# Altium schematic sheet Power.SchDoc
size A4; SheetNumber: 4; SheetTotal: 10
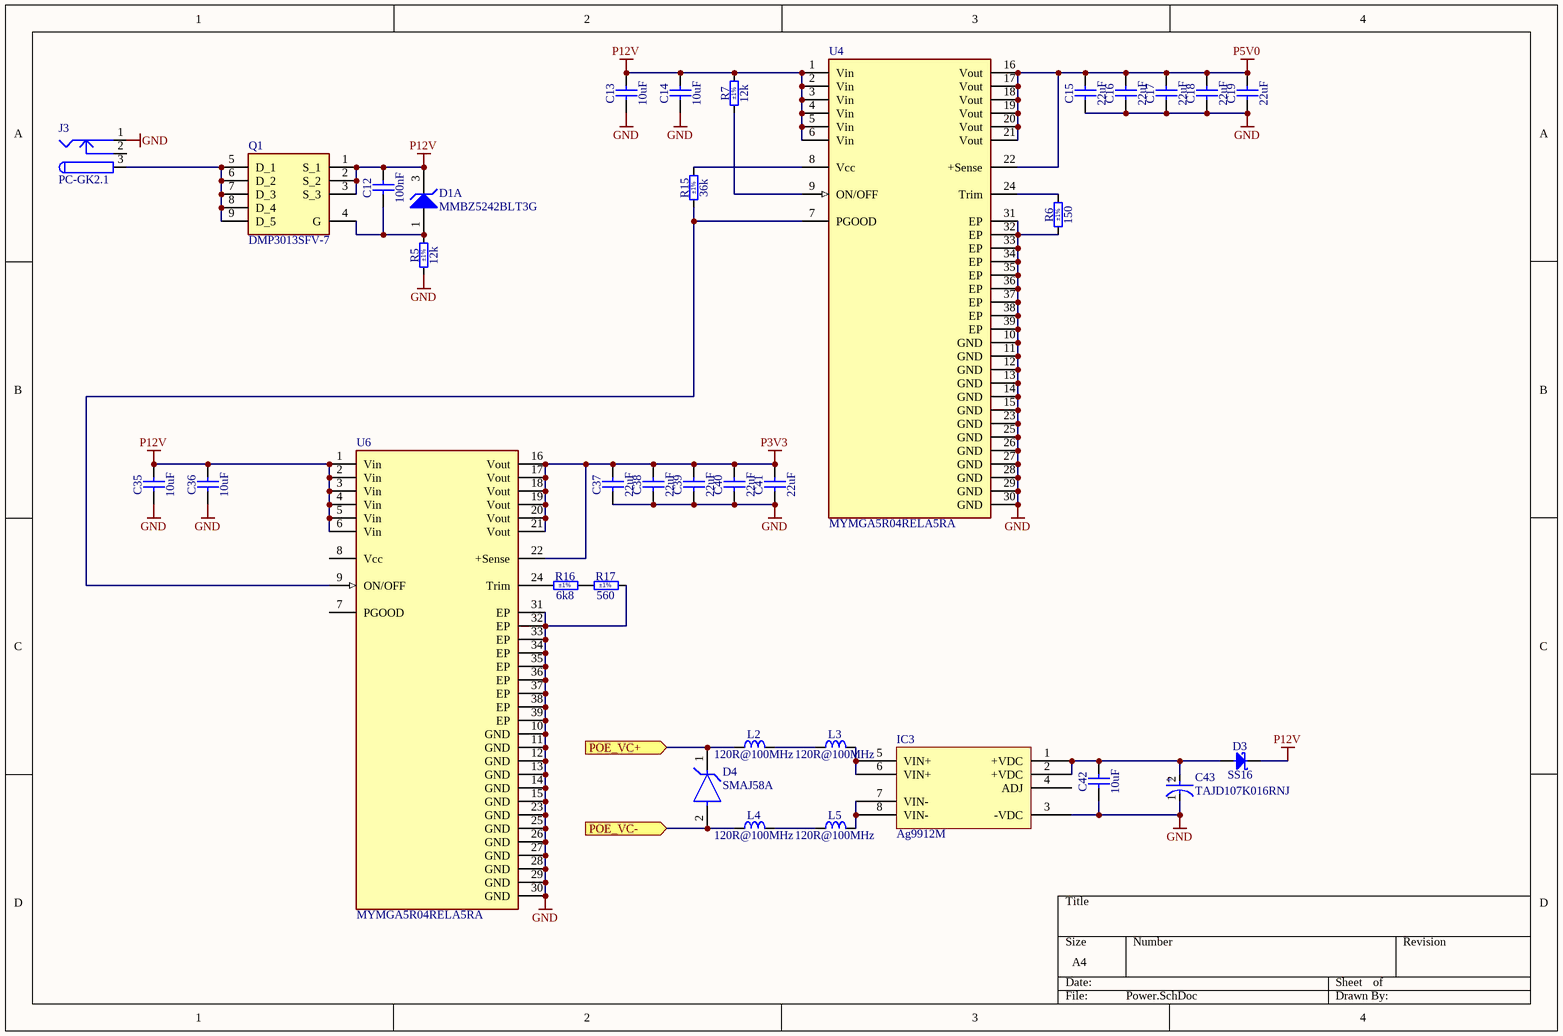
[diagram p0: Power.SchDoc]

## Parts
C12  100nF  [CAPC1005X55N]
C13  10uF  [CAPC2012X95N]
C14  10uF  [CAPC2012X95N]
C15  22uF  [CAPC2012X135N]
C16  22uF  [CAPC2012X135N]
C17  22uF  [CAPC2012X135N]
C18  22uF  [CAPC2012X135N]
C19  22uF  [CAPC2012X135N]
C35  10uF  [CAPC2012X95N]
C36  10uF  [CAPC2012X95N]
C37  22uF  [CAPC2012X135N]
C38  22uF  [CAPC2012X135N]
C39  22uF  [CAPC2012X135N]
C40  22uF  [CAPC2012X135N]
C41  22uF  [CAPC2012X135N]
C42  10uF  [CAPC2012X95N]
C43  TAJD107K016RNJ  [FP-TAJD-MFG]
D1  MMBZ5242BLT3G  [ONSC-SOT-23-3-318-08_V]  (part A of 2)
D3  SS16  [DIOM5127X229N]
D4  SMAJ58A  [FP-SMAJ-MFG]
IC3  Ag9912M  [Ag9900M]
J3  PC-GK2.1  [DC2020]
L2  120R@100MHz  [INDC1608X65N]
L3  120R@100MHz  [INDC1608X65N]
L4  120R@100MHz  [INDC1608X65N]
L5  120R@100MHz  [INDC1608X65N]
Q1  DMP3013SFV-7  [DMP3013SFV7]
R5  12k  Tolerance: ±1%  [RESC1005X40N]
R6  150  Tolerance: ±1%  [RESC1005X40N]
R7  12k  Tolerance: ±1%  [RESC1005X40N]
R15  36k  Tolerance: ±1%  [RESC1005X40N]
R16  6k8  Tolerance: ±1%  [RESC1005X40N]
R17  560  Tolerance: ±1%  [RESC1005X40N]
U4  MYMGA5R04RELA5RA  [FP-MYMGA-MFG]
U6  MYMGA5R04RELA5RA  [FP-MYMGA-MFG]

## Ports
POE_VC+ (in), POE_VC- (in)

## Nets
GND: C13.1 C14.1 C15.1 C16.1 C17.1 C18.1 C19.1 C35.1 C36.1 C37.1 C38.1 C39.1 C40.1 C41.1 C42.1 C43.1(C) IC3.3(-VDC) J3.1 R5.1 R6.1 R17.2 U4.10(GND) U4.11(GND) U4.12(GND) U4.13(GND) U4.14(GND) U4.15(GND) U4.23(GND) U4.25(GND) U4.26(GND) U4.27(GND) U4.28(GND) U4.29(GND) U4.30(GND) U4.31(EP) U4.32(EP) U4.33(EP) U4.34(EP) U4.35(EP) U4.36(EP) U4.37(EP) U4.38(EP) U4.39(EP) U6.10(GND) U6.11(GND) U6.12(GND) U6.13(GND) U6.14(GND) U6.15(GND) U6.23(GND) U6.25(GND) U6.26(GND) U6.27(GND) U6.28(GND) U6.29(GND) U6.30(GND) U6.31(EP) U6.32(EP) U6.33(EP) U6.34(EP) U6.35(EP) U6.36(EP) U6.37(EP) U6.38(EP) U6.39(EP)
P3V3: C37.2 C38.2 C39.2 C40.2 C41.2 U6.16(Vout) U6.17(Vout) U6.18(Vout) U6.19(Vout) U6.20(Vout) U6.21(Vout) U6.22(+Sense)
P5V0: C15.2 C16.2 C17.2 C18.2 C19.2 U4.16(Vout) U4.17(Vout) U4.18(Vout) U4.19(Vout) U4.20(Vout) U4.21(Vout) U4.22(+Sense)
P12V: C12.2 C13.2 C14.2 C35.2 C36.2 D1.3(K) D3.1(C) Q1.1(S_1) Q1.2(S_2) Q1.3(S_3) R7.2 U4.1(Vin) U4.2(Vin) U4.3(Vin) U4.4(Vin) U4.5(Vin) U4.6(Vin) U6.1(Vin) U6.2(Vin) U6.3(Vin) U6.4(Vin) U6.5(Vin) U6.6(Vin)
POE_VC+: D4.1(C) L2.1 ; port POE_VC+
POE_VC-: D4.2(A) L4.1 ; port POE_VC-
NetC12_1: C12.1 D1.1(A) Q1.4(G) R5.2
NetC42_2: C42.2 C43.2(A) D3.2(A) IC3.1(+VDC) IC3.2(+VDC)
NetIC3_5: IC3.5(VIN+) IC3.6(VIN+) L3.2
NetIC3_7: IC3.7(VIN-) IC3.8(VIN-) L5.2
NetJ3_3: J3.3 Q1.5(D_1) Q1.6(D_2) Q1.7(D_3) Q1.8(D_4) Q1.9(D_5)
NetL2_2: L2.2 L3.1
NetL4_2: L4.2 L5.1
NetR6_2: R6.2 U4.24(Trim)
NetR7_1: R7.1 U4.9(ON/OFF)
NetR15_1: R15.1 U4.7(PGOOD) U6.9(ON/OFF)
NetR15_2: R15.2 U4.8(Vcc)
NetR16_1: R16.1 U6.24(Trim)
NetR16_2: R16.2 R17.1

Not connected (* = marked no-connect by the designer): IC3 4(ADJ); J3 2; U6 7(PGOOD) 8(Vcc)

## Notes on the sheet
- (in symbol CMP-2000-05064-2) +

## Library data of the parts
C12 = CC0402_100NF_16V_10%_X5R: Non-polarised capacitor; Manufacturer: GENERIC; Part Description: SMD Multilayer Chip Ceramic Capacitor; Manufacturer1 Part Number: GRM155R61C104KA88D; Tolerance: ±10%; Voltage: 16V; TC: X5R; Manufacturer Part Number: CC0402_100NF_16V_10%_X5R; Part Number: CC0402_100NF_16V_10%_X5R; Value: 100nF; Component Kind: Standard; Component Type: Standard; Pin Count: 2; Status: None; Case: 0402; Mounted: Yes; Socket: No; SMD: Yes; Sense: No; Manufacturer1 Example: MURATA; Manufacturer1 ComponentHeight: 0.55mm; HelpURL: \\cern.ch\dfs\Applications\Altium\Datasheets\CC0402_X5R_MURATA_GRM.pdf; Author: CERN DEM JLC; CreateDate: 10.12.2013; LatestRevisionDate: 10.12.2013
C13 C14 C35 C36 C42 = CC0805_10UF_25V_10%_X5R: Non-polarised capacitor; Part Description: SMD Multilayer Chip Ceramic Capacitor; Manufacturer: GENERIC; Manufacturer1 Part Number: GRM219R61E106KA12D; Voltage: 25V; TC: X5R; Tolerance: ±10%; Part Number: CC0805_10UF_25V_10%_X5R; Component Kind: Standard; Component Type: Standard; Pin Count: 2; Value: 10uF; Status: Preferred; Manufacturer Part Number: CC0805_10UF_25V_10%_X5R; Case: 0805; Mounted: Yes; Socket: No; SMD: Yes; Sense: No; Manufacturer1 Example: MURATA; Manufacturer1 ComponentHeight: 0.95mm; HelpURL: \\cern.ch\dfs\Applications\Altium\Datasheets\CC0805_X5R_MURATA_GRM.pdf; Author: CERN DEM JLC; CreateDate: 25.10.2012; LatestRevisionDate: 06.09.2016
C15-C19 C37-C41 = CC0805_22UF_10V_+80%-20%_Y5V: Non-polarised capacitor; Part Description: SMD Multilayer Chip Ceramic Capacitor; Manufacturer: GENERIC; Manufacturer1 Part Number: 2222 241 19881; Voltage: 10V; TC: Y5V; Part Number: CC0805_22UF_10V_+80%-20%_Y5V; Component Kind: Standard; Component Type: Standard; Pin Count: 2; Value: 22uF; Status: Preferred; Tolerance: +80% -20%; Manufacturer Part Number: CC0805_22UF_10V_+80%-20%_Y5V; Case: 0805; Mounted: Yes; Socket: No; SMD: Yes; Sense: No; Manufacturer1 Example: PHYCOMP; Manufacturer1 ComponentHeight: 1.45mm; HelpURL: \\cern.ch\dfs\Applications\Altium\Datasheets\CC0805_Y5V_PHYCOMP.pdf; Author: CERN DEM JLC; CreateDate: 03.12.2007; LatestRevisionDate: 03.12.2007
C43 = CMP-2000-05064-2: 100uF 16V  ±10% 600mΩ 2917  SMD Tantalum Capacitor; Dissipation Factor: 6%; Polarity: Polar; Leakage Current: 16uA; ESR (Equivalent Series Resistance): 600mR; Depth: 4.3mm; Series: TAJ; Case Code (Metric): 7343; Min Operating Temperature: -55°C; Packaging: Tape and Reel; Termination: SMD/SMT; Voltage Rating (DC): 16V; Case/Package: 2917; Number of Pins: 2; Width: 4.3mm; Mount: Surface Mount; Tolerance: 10%; Voltage: 16V; Radiation Hardening: No; Lead Free: Lead Free; Capacitance: 100uF; Height: 2.9mm; RoHS Compliant: Yes; Max Operating Temperature: 125°C; Construction: Flat; Height - Seated (Max): 0.122inch; Case Code (Imperial): 2917; Package Quantity: 1; Dielectric Material: Tantalum; REACH SVHC: No SVHC; Features: General Purpose; Voltage Rating: 16V; Length: 7.3mm
D1 = CMP-1060-01195-1: Zener Voltage Regulator, 225 mW, 3-Pin SOT-23, Pb-Free, Tape and Reel; Manufacturer: On Semiconductor; VZ Typ (V): 12; PackageReference: SOT-23-3-318-08; RoHS: Pb-Free; PartNumber: MMBZ5242BLT3G; ComponentLink1Description: Manufacturer URL; ComponentLink3Description: Package Specification; ComponentLink3URL: http://www.onsemi.cn/pub_link/Collateral/318-08.PDF; PackageVersion: Rev. AP, 11/2009; ComponentLink1URL: http://www.onsemi.com/; Packing: Tape and Reel; ComponentLink2URL: http://www.onsemi.cn/pub_link/Collateral/MMBZ5221BLT1-D.PDF; PackageDescription: 3-Pin Small Outline Transistor, Body 2.92 x 1.3 mm, Pitch 0.95 mm; DatasheetVersion: Rev. 12; ComponentLink2Description: Datasheet; Mounting Technology: Surface Mount
D3 = SS16: Schottky Diode; Part Description: Surface Mount Schottky Barrier Rectifier; Manufacturer: VISHAY GENERAL SEMICONDUCTOR; Voltage: 60V; Power: 1A; PressFit: No; Bonding: No; Part Number: SS16; Component Kind: Standard; Component Type: Standard; Device: SS16; PackageDescription: DO-214-AC Molded Diode, Body 5.1x2.7mm, IPC Medium Density; Manufacturer Part Number: SS16; Pin Count: 2; Case: DO-214AC; Mounted: Yes; Socket: No; SMD: Yes; Sense: No; ComponentHeight: 2.29mm; HelpURL: \\cern.ch\dfs\Applications\Altium\Datasheets\SS16.pdf; Author: CERN DEM JLC; CreateDate: 15.07.2008; LatestRevisionDate: 23.08.2010
D4 = CMP-07401-000004-1: TVS DIODE 58V 93.6V SMA; Manufacturer: Bourns Inc.; Max Junction Temp: +150°C; Breakdown Voltage: 64.4V; Number Of Channels: 1; Peak Pulse Power: 400W; Peak Pulse Current: 4.3A; Direction: Unidirectional; Temperature Range High: +150°C; Clamping Voltage: 93.6V; Package: SMAJ; ComponentLink2Description: Datasheet; Temperature Range Low: -55°C; Mouser Description: TVS Diodes - Transient Voltage Suppressors 58volts 5uA 4.3 Amps Uni-Dir; Category: Diode; ComponentLink2URL: https://www.bourns.com/docs/Product-Datasheets/SMAJ.pdf; Temperature: -55°C to +150°C; Device Class L3: unset; Automotive: No; Device Class L2: TVS Diodes; Digikey Description: TVS DIODE 58V 93.6V SMA; Lead Free: Yes; Octopart: https://octopart.com/smaj58a-bourns-12809395; Device Class L1: Circuit Protection; Manufacturer Part Number: SMAJ58A; Reverse Standoff Voltage: 58V; Height: 2.29mm; RoHS: TRUE
IC3 = Ag9900M
J3 = CON_DC_JACK_TH: Low Voltage Power Supply Connector (maritex); Published: 17-Dec-2003; Datasheet: Latest Revision: 09-May-2002; Publisher: Altium Limited; Supplier 1: TME; Supplier Part Number 1: PC-GK2.1
L2-L5 = IND0603_MURATA_BLM18SG121TN1D: Inductor; Part Description: SMD EMIFIL Suppression Chip Ferrite Bead; Manufacturer: MURATA; Power: 3A; Resistance: 0.025R; Tolerance: ±25%; Table: Inductors SMD; Part Number: IND0603_MURATA_BLM18SG121TN1D; Component Kind: Standard; Component Type: Standard; Pin Count: 2; Value: 120R@100MHz; Status: None; Manufacturer Part Number: BLM18SG121TN1D; Case: 0603; Mounted: Yes; Socket: No; SMD: Yes; ComponentHeight: 0.65mm; HelpURL: \\cern.ch\dfs\Applications\Altium\Datasheets\IND0603_MURATA_BLM18S.pdf; Author: CERN DEM JLC; CreateDate: 2014-07-23; LatestRevisionDate: 2014-07-23
Q1 = DMP3013SFV-7: MOSFET (P-Channel); Manufacturer_Name: Diodes Inc.; Datasheet Link: https://4donline.ihs.com/images/VipMasterIC/IC/DIOD/DIOD-S-A0008513542/DIOD-S-A0008513542-1.pdf?hkey=52A5661711E402568146F3353EA87419; Height: 0.85mm; Manufacturer_Part_Number: DMP3013SFV-7
R5 R7 = R0402_12K_1%_0.0625W_100PPM: Resistor - 1%; Part Description: General Purpose Thick Film Chip Resistor; Manufacturer: GENERIC; Manufacturer1 Part Number: 232270671203L; TC: ±100ppm/°C; PressFit: No; Part Number: R0402_12K_1%_0.0625W_100PPM; Component Kind: Standard; Component Type: Standard; Pin Count: 2; Value: 12k; Status: Not Recommended; Power: 0.0625W; Manufacturer Part Number: R0402_12K_1%_0.0625W_100PPM; Case: 0402; Mounted: Yes; Sense: No; Socket: No; SMD: Yes; Manufacturer1 Example: YAGEO PHYCOMP; Manufacturer1 ComponentHeight: 0.4mm; HelpURL: \\cern.ch\dfs\Applications\Altium\Datasheets\R0402_Phycomp_RC0402.pdf; Author: CERN DEM JLC; CreateDate: 03.12.2007; LatestRevisionDate: 17.10.2012
R6 = R0402_150R_1%_0.0625W_100PPM: Resistor - 1%; Part Description: General Purpose Thick Film Chip Resistor; Manufacturer: GENERIC; Manufacturer1 Part Number: 232270671501L; TC: ±100ppm/°C; PressFit: No; Part Number: R0402_150R_1%_0.0625W_100PPM; Component Kind: Standard; Component Type: Standard; Pin Count: 2; Value: 150; Status: Not Recommended; Power: 0.0625W; Manufacturer Part Number: R0402_150R_1%_0.0625W_100PPM; Case: 0402; Mounted: Yes; Sense: No; Socket: No; SMD: Yes; Manufacturer1 Example: YAGEO PHYCOMP; Manufacturer1 ComponentHeight: 0.4mm; HelpURL: \\cern.ch\dfs\Applications\Altium\Datasheets\R0402_Phycomp_RC0402.pdf; Author: CERN DEM JLC; CreateDate: 03.12.2007; LatestRevisionDate: 17.10.2012
R15 = R0402_36K_1%_0.0625W_100PPM: Resistor - 1%; Part Description: General Purpose Thick Film Chip Resistor; Manufacturer: GENERIC; Manufacturer1 Part Number: 232270673603L; TC: ±100ppm/°C; PressFit: No; Part Number: R0402_36K_1%_0.0625W_100PPM; Component Kind: Standard; Component Type: Standard; Pin Count: 2; Value: 36k; Status: Not Recommended; Power: 0.0625W; Manufacturer Part Number: R0402_36K_1%_0.0625W_100PPM; Case: 0402; Mounted: Yes; Sense: No; Socket: No; SMD: Yes; Manufacturer1 Example: YAGEO PHYCOMP; Manufacturer1 ComponentHeight: 0.4mm; HelpURL: \\cern.ch\dfs\Applications\Altium\Datasheets\R0402_Phycomp_RC0402.pdf; Author: CERN DEM JLC; CreateDate: 03.12.2007; LatestRevisionDate: 17.10.2012
R16 = R0402_6K8_1%_0.0625W_100PPM: Resistor - 1%; Part Description: General Purpose Thick Film Chip Resistor; Manufacturer: GENERIC; Manufacturer1 Part Number: 232270676802L; TC: ±100ppm/°C; PressFit: No; Part Number: R0402_6K8_1%_0.0625W_100PPM; Component Kind: Standard; Component Type: Standard; Pin Count: 2; Value: 6k8; Status: Not Recommended; Power: 0.0625W; Manufacturer Part Number: R0402_6K8_1%_0.0625W_100PPM; Case: 0402; Mounted: Yes; Sense: No; Socket: No; SMD: Yes; Manufacturer1 Example: YAGEO PHYCOMP; Manufacturer1 ComponentHeight: 0.4mm; HelpURL: \\cern.ch\dfs\Applications\Altium\Datasheets\R0402_Phycomp_RC0402.pdf; Author: CERN DEM JLC; CreateDate: 03.12.2007; LatestRevisionDate: 17.10.2012
R17 = R0402_560R_1%_0.0625W_100PPM: Resistor - 1%; Part Description: General Purpose Thick Film Chip Resistor; Manufacturer: GENERIC; Manufacturer1 Part Number: 232270675601L; TC: ±100ppm/°C; PressFit: No; Part Number: R0402_560R_1%_0.0625W_100PPM; Component Kind: Standard; Component Type: Standard; Pin Count: 2; Value: 560; Status: Not Recommended; Power: 0.0625W; Manufacturer Part Number: R0402_560R_1%_0.0625W_100PPM; Case: 0402; Mounted: Yes; Sense: No; Socket: No; SMD: Yes; Manufacturer1 Example: YAGEO PHYCOMP; Manufacturer1 ComponentHeight: 0.4mm; HelpURL: \\cern.ch\dfs\Applications\Altium\Datasheets\R0402_Phycomp_RC0402.pdf; Author: CERN DEM JLC; CreateDate: 03.12.2007; LatestRevisionDate: 17.10.2012
U4 U6 = CMP-20596-000031-1: DC DC CONVERTER 3.3-5V 20W; RoHS Compliant: Yes